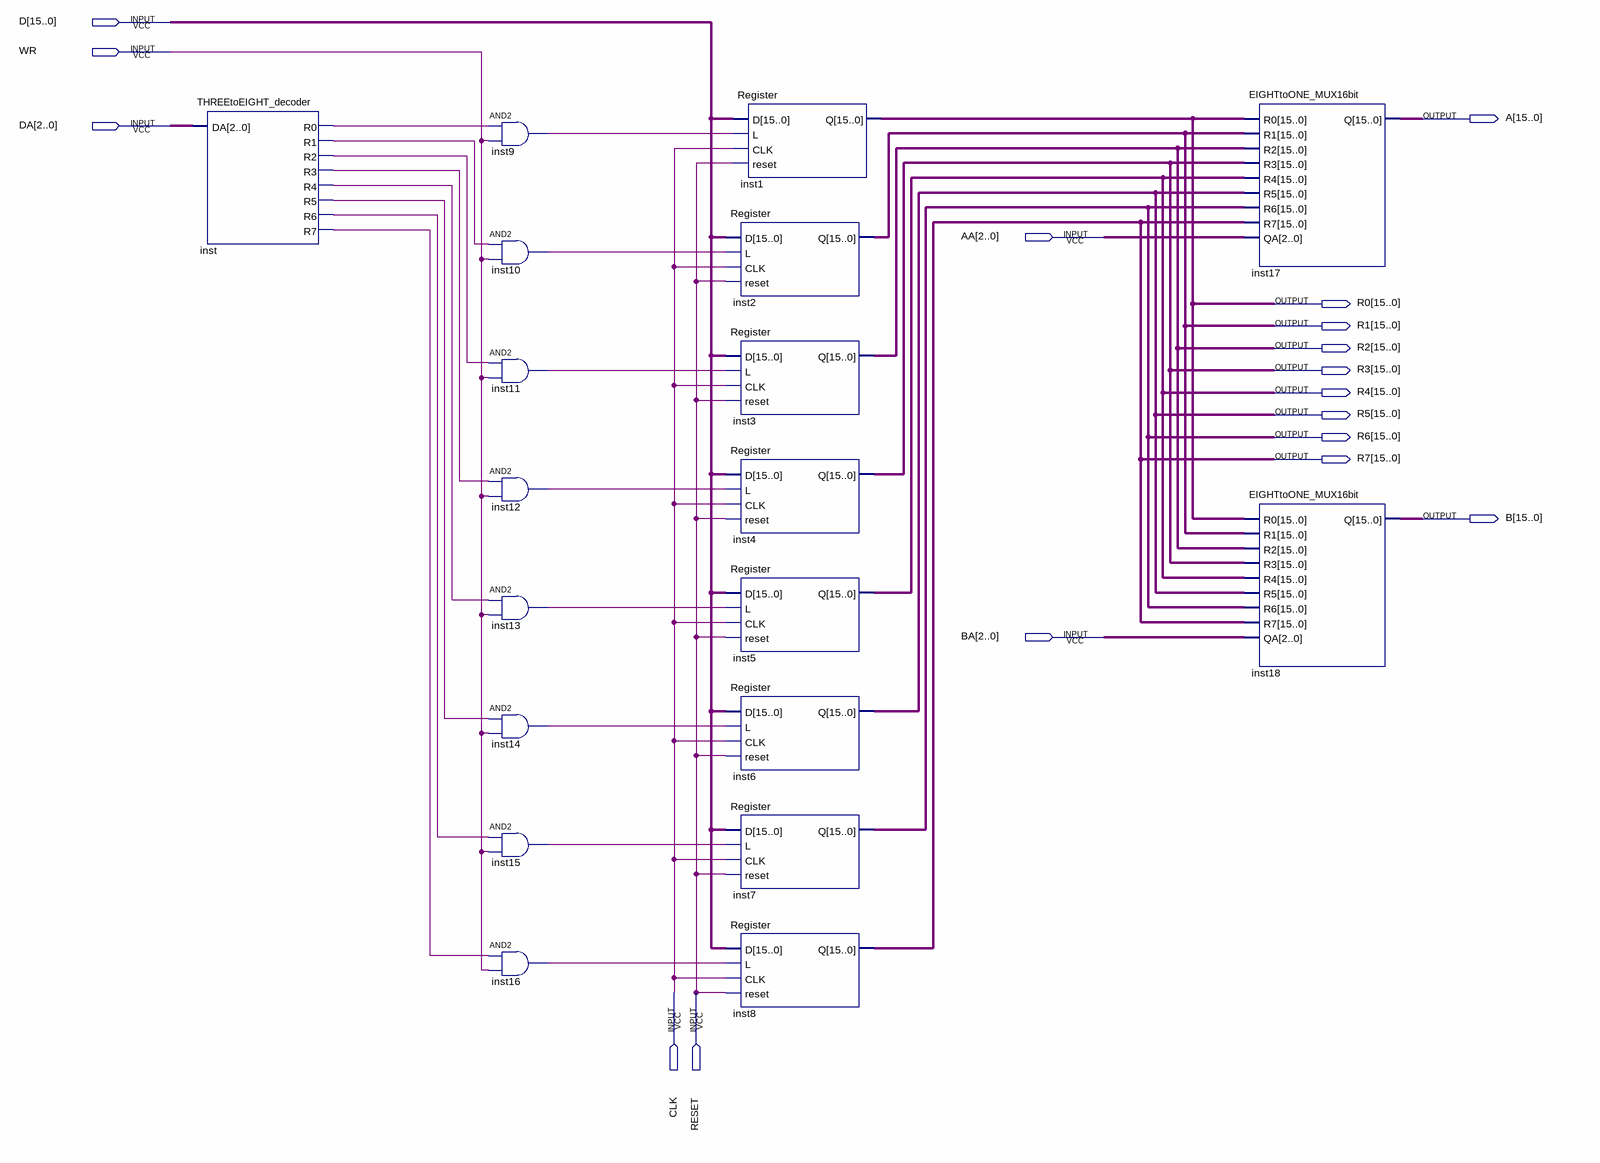
[diagram p0: schematic sheet]
// Quartus schematic Register_File.bdf as structural Verilog: 19 symbols, 17 pins
module Register_File (
  input  [15:0] D,
  input  WR,
  input  [2:0] DA,
  input  [2:0] AA,
  input  [2:0] BA,
  input  CLK,
  input  RESET,
  output [15:0] A,
  output [15:0] R0,
  output [15:0] R1,
  output [15:0] R2,
  output [15:0] R3,
  output [15:0] R4,
  output [15:0] R5,
  output [15:0] R6,
  output [15:0] R7,
  output [15:0] B
);

  wire inst9_out, inst10_out, inst11_out, inst12_out, inst13_out, inst14_out, inst15_out, inst16_out,
       inst_r0, inst_r1, inst_r2, inst_r3, inst_r4, inst_r5, inst_r6, inst_r7;

  THREEtoEIGHT_decoder inst (
    .DA(DA), .R0(inst_r0), .R1(inst_r1), .R2(inst_r2), .R3(inst_r3), .R4(inst_r4), .R5(inst_r5),
    .R6(inst_r6), .R7(inst_r7));
  and inst9 (inst9_out, inst_r0, WR);
  and inst10 (inst10_out, inst_r1, WR);
  and inst11 (inst11_out, inst_r2, WR);
  and inst12 (inst12_out, inst_r3, WR);
  and inst13 (inst13_out, inst_r4, WR);
  and inst14 (inst14_out, inst_r5, WR);
  and inst15 (inst15_out, inst_r6, WR);
  and inst16 (inst16_out, inst_r7, WR);
  Register inst1 (.D(D), .L(inst9_out), .CLK(CLK), .reset(RESET), .Q(R0));
  Register inst2 (.D(D), .L(inst10_out), .CLK(CLK), .reset(RESET), .Q(R1));
  Register inst3 (.D(D), .L(inst11_out), .CLK(CLK), .reset(RESET), .Q(R2));
  Register inst4 (.D(D), .L(inst12_out), .CLK(CLK), .reset(RESET), .Q(R3));
  Register inst5 (.D(D), .L(inst13_out), .CLK(CLK), .reset(RESET), .Q(R4));
  Register inst6 (.D(D), .L(inst14_out), .CLK(CLK), .reset(RESET), .Q(R5));
  Register inst7 (.D(D), .L(inst15_out), .CLK(CLK), .reset(RESET), .Q(R6));
  Register inst8 (.D(D), .L(inst16_out), .CLK(CLK), .reset(RESET), .Q(R7));
  EIGHTtoONE_MUX16bit inst17 (.R0(R0), .R1(R1), .R2(R2), .R3(R3), .R4(R4), .R5(R5), .R6(R6), .R7(R7), .QA(AA), .Q(A));
  EIGHTtoONE_MUX16bit inst18 (.R0(R0), .R1(R1), .R2(R2), .R3(R3), .R4(R4), .R5(R5), .R6(R6), .R7(R7), .QA(BA), .Q(B));
endmodule
